# Altium schematic sheet Peripherals.SchDoc
size A4; SheetNumber: 4; SheetTotal: 7
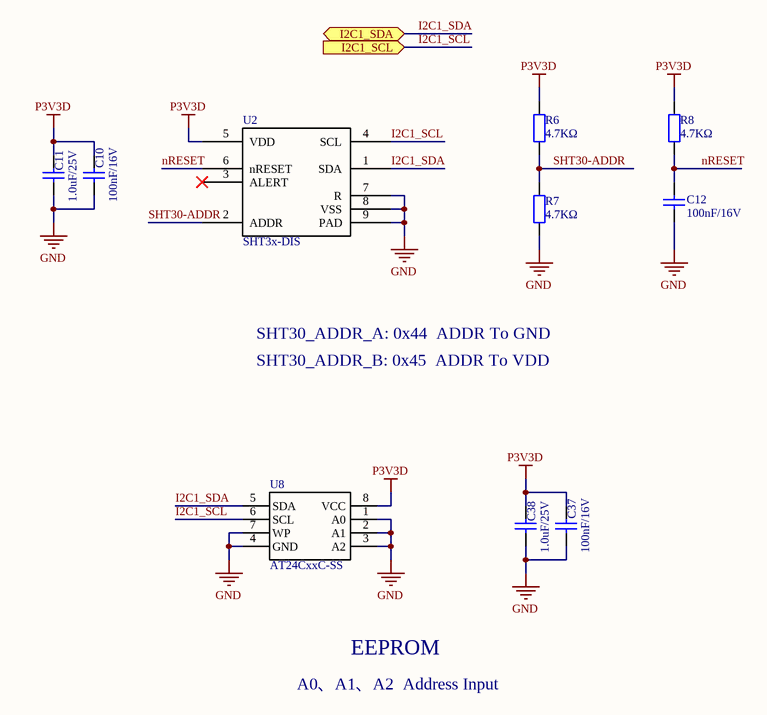
[diagram p0: Peripherals.SchDoc]

## Parts
C10  100nF/16V  [0402_C]
C11  1.0uF/25V  [0402_C]
C12  100nF/16V  [0402_C]
C37  100nF/16V  [0402_C]
C38  1.0uF/25V  [0402_C]
R6  4.7KΩ  [0402_R]
R7  4.7KΩ  [0402_R]
R8  4.7KΩ  [0402_R]
U2  SHT3x-DIS  [SHT3x-DIS_SEN]
U8  AT24CxxC-SS  [SOIC-8-39mm]

## Ports
I2C1_SCL (in), I2C1_SDA (bidir)

## Nets
GND: C10.1 C11.1 C12.1 C37.1 C38.1 R7.1 U2.7(R) U2.8(VSS) U2.9(PAD) U8.1(A0) U8.2(A1) U8.3(A2) U8.4(GND) U8.7(WP)
P3V3D: C10.2 C11.2 C37.2 C38.2 R6.2 R8.2 U2.5(VDD) U8.8(VCC)
I2C1_SCL: U2.4(SCL) U8.6(SCL) ; port I2C1_SCL
I2C1_SDA: U2.1(SDA) U8.5(SDA) ; port I2C1_SDA
nRESET: C12.2 R8.1 U2.6(nRESET)
SHT30-ADDR: R6.1 R7.2 U2.2(ADDR)

Not connected (* = marked no-connect by the designer): U2 3(ALERT)*

## Notes on the sheet
- SHT30_ADDR_A: 0x44  ADDR To GND
- SHT30_ADDR_B: 0x45  ADDR To VDD
- A0、A1、A2  Address Input
- EEPROM
- Date:
- Size:
- Project Title:
- A4
- Revision:
- Sheet:
- of:
- File:
- Author:
- Chenhui Zhao

## Library data of the parts
C10 C12 C37 = 0402 100nF (104) 10% 16V: 贴片电容; ComponentLink1Description: 供应商链接; ComponentLink1URL: http://www.szlcsc.com/product/details_1877.html; Package: 0402; Supplier: LC; SuppliersPartNumber: C1525
C11 C38 = 0402 1.0uF (105) 10% 25V: 贴片电容; ComponentLink1Description: 供应商链接; ComponentLink1URL: http://www.szlcsc.com/product/details_53938.html; Package: 0402; Supplier: LC; SuppliersPartNumber: C52923
R6-R8 = 0402 4.7KΩ (4701) 1%: 贴片电阻; ComponentLink1Description: 供应商链接; ComponentLink1URL: http://www.szlcsc.com/product/details_26643.html; Package: 0402; Supplier: LC; SuppliersPartNumber: C25900
U2 = SHT3x-DIS: Humidity and Temperature Sensor; Manufacturer_Part_Number: SHT30-DIS-F2.5KS; Vendor: Sensirion; Built_By: EMA_Cory; SourceLibrary: Sensirion_2020-07-31; Datasheet: https://media.digikey.com/pdf/Data%20Sheets/Sensirion%20PDFs/HT_DS_SHT3x_DIS.pdf; Copyright: Copyright (C) 2018 Accelerated Designs. All rights reserved; RefDes: RefDes; Type: DEV
U8 = AT24CxxC-SS: Serial EEPROM